# EAGLE schematic isoHV v0.7 (EAGLE 9.4.1)
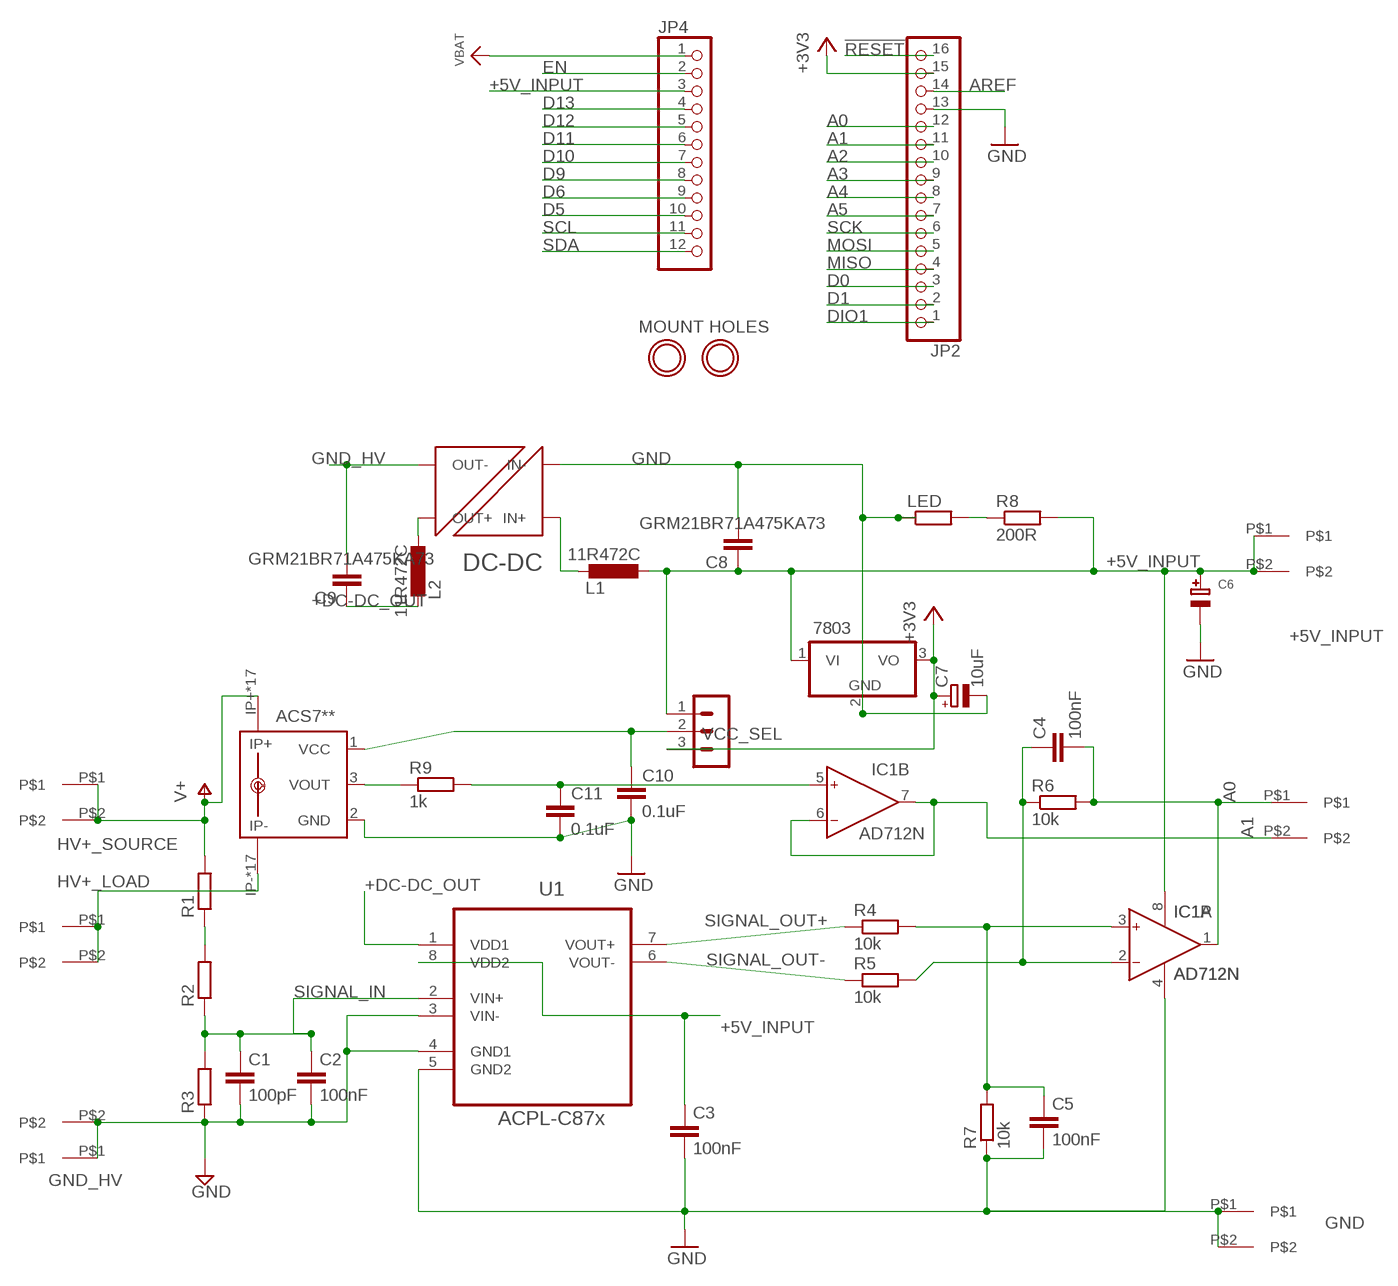
[diagram p0: schematic, sheet 1]

## Parts
7803  7805TV  [TO220V]
ACS7**  ACS758KCB-150B-PFF-T  [CB-PFF]
C1  100pF  C-EU025-025X050  [C025-025X050]
C2  100nF  C-EU025-025X050  [C025-025X050]
C3  100nF  C-EU025-025X050  [C025-025X050]
C4  100nF  C-EU025-025X050  [C025-025X050]
C5  100nF  C-EU025-025X050  [C025-025X050]
C6  CAP_ELECTROLYTICPTH_3.5MMGRID_10MMDIA  [CELEC_3.5MM_10MM]
C7  10uF  CPOL-EUB45181A  [B45181A]
C8  GRM21BR71A475KA73  C-EU025-025X050  [C025-025X050]
C9  GRM21BR71A475KA73  C-EU025-050X050  [C025-050X050]
C10  0.1uF  C-EU025-025X050  [C025-025X050]
C11  0.1uF  C-EU025-025X050  [C025-025X050]
IC1  AD712N  [DIL08]
JP2  HEADER-1X16ROUND  [1X16_ROUND]
JP4  HEADER-1X12  [1X12_ROUND]
L1  11R472C  L-EU0204V  [0204V]
L2  11R472C  L-EU0204V  [0204V]
LED  R-EU_0204/2V  [0204V]
R1  R-EU_0411/15  [0411/15]
R2  R-EU_0411/15  [0411/15]
R3  R-EU_0411/15  [0411/15]
R4  10k  R-EU_0204/7  [0204/7]
R5  10k  R-EU_0204/7  [0204/7]
R6  10k  R-EU_0204/7  [0204/7]
R7  10k  R-EU_0204/7  [0204/7]
R8  200R  R-EU_0204/2V  [0204V]
R9  1k  R-EU_0204/7  [0204/7]
U1  ACPL-C87x  ACPL-C79B-000E  [SOIC127P1150X330-8N]
U$1  7.62MM_TERMINAL_BLOCK  [7.62MM]
U$2  7.62MM_TERMINAL_BLOCK  [7.62MM]
U$3  7.62MM_TERMINAL_BLOCK  [7.62MM]
U$4  7.62MM_TERMINAL_BLOCK  [7.62MM]
U$5  7.62MM_TERMINAL_BLOCK  [7.62MM]
U$6  7.62MM_TERMINAL_BLOCK  [7.62MM]
U$7  NXF1  [NXF1]
U$12  MOUNTINGHOLE2.5  [MOUNTINGHOLE_2.5_PLATED]
U$13  MOUNTINGHOLE2.5  [MOUNTINGHOLE_2.5_PLATED]
VCC_SEL  MA03-1  [MA03-1]

## Nets
!RESET: JP2.16
+3V3: 7803.3(VO) C7.+ JP2.15 VCC_SEL.3
+5V_INPUT: 7803.1(VI) C3.1 C6.+ C8.1 IC1.8(P:V+) JP4.3 L1.2 R8.2 U1.8(VDD2) U$3.P$1 U$3.P$2 VCC_SEL.1
+DC-DC_OUT: C9.1 L2.1 U1.1(VDD1)
A0: C4.2 IC1.1(A:OUT) JP2.12 R6.2 U$5.P$1
A1: IC1.6(B:IN-) IC1.7(B:OUT) JP2.11 U$5.P$2
A2: JP2.10
A3: JP2.9
A4: JP2.8
A5: JP2.7
AREF: JP2.14
D0: JP2.3
D1: JP2.2
D5: JP4.10
D6: JP4.9
D9: JP4.8
D10: JP4.7
D11: JP4.6
D12: JP4.5
D13: JP4.4
DIO1: JP2.1
EN: JP4.2
GND: 7803.2(GND) ACS7**.2(GND) C3.2 C5.2 C6.- C7.- C8.2 C10.2 C11.2 IC1.4(P:V-) JP2.13 LED.1 R7.1 U1.5(GND2) U$4.P$1 U$4.P$2 U$7.P$1(IN-)
GND_HV: C1.2 C2.2 C9.2 R3.1 U1.3(VIN-) U1.4(GND1) U$2.P$1 U$2.P$2 U$7.P$7(OUT-) ; supply symbol labelled GND
HV+_LOAD: ACS7**.IP- ACS7**.IP-@2(IP-) ACS7**.IP-@3(IP-) ACS7**.IP-@4(IP-) ACS7**.IP-@5(IP-) ACS7**.IP-@6(IP-) ACS7**.IP-@7(IP-) ACS7**.IP-@8(IP-) ACS7**.IP-@9(IP-) ACS7**.IP-@10(IP-) ACS7**.IP-@11(IP-) ACS7**.IP-@12(IP-) ACS7**.IP-@13(IP-) ACS7**.IP-@14(IP-) ACS7**.IP-@15(IP-) ACS7**.IP-@16(IP-) ACS7**.IP-@17(IP-) U$6.P$1 U$6.P$2
HV+_SOURCE: ACS7**.IP+ ACS7**.IP+@2(IP+) ACS7**.IP+@3(IP+) ACS7**.IP+@4(IP+) ACS7**.IP+@5(IP+) ACS7**.IP+@6(IP+) ACS7**.IP+@7(IP+) ACS7**.IP+@8(IP+) ACS7**.IP+@9(IP+) ACS7**.IP+@10(IP+) ACS7**.IP+@11(IP+) ACS7**.IP+@12(IP+) ACS7**.IP+@13(IP+) ACS7**.IP+@14(IP+) ACS7**.IP+@15(IP+) ACS7**.IP+@16(IP+) ACS7**.IP+@17(IP+) R1.2 U$1.P$1 U$1.P$2 ; supply symbol labelled V+
MISO: JP2.4
MOSI: JP2.5
N$1: C5.1 IC1.3(A:IN+) R4.2 R7.2
N$2: R1.1 R2.2
N$3: ACS7**.1(VCC) C10.1 VCC_SEL.2
N$4: LED.2 R8.1
N$5: C4.1 IC1.2(A:IN-) R5.2 R6.1
N$6: C11.1 IC1.5(B:IN+) R9.2
N$7: L1.1 U$7.P$3(IN+)
N$8: L2.2 U$7.P$8(OUT+)
N$9: ACS7**.3(VOUT) R9.1
SCK: JP2.6
SCL: JP4.11
SDA: JP4.12
SIGNAL_IN: C1.1 C2.1 R2.1 R3.2 U1.2(VIN+)
SIGNAL_OUT+: R4.1 U1.7(VOUT+)
SIGNAL_OUT-: R5.1 U1.6(VOUT-)
VBAT: JP4.1

## Notes on the sheet
- MOUNT HOLES

## Library data of the parts
7803 = linear:78*: Positive VOLTAGE REGULATOR Source: http://cache.national.com/ds/LM/LM78L05.pdf http://www.fairchildsemi.com/ds/LM/LM7805.pdf
ACS7** = allegro:ACS758*: Thermally Enhanced, Fully Integrated, Hall Effect-Based Linear Current Sensor with 100 micro Ohm Current Conductor display layer 49 Reference in BRD and place VIAs on circles Source: http://www.allegromicro.com/en/Products/Part_Numbers/0758/0758.pdf; MPN: ACS7**; OC_FARNELL: 1718995; OC_NEWARK: 04R7129
C1-C5 C8-C11 = rcl:C-EU: CAPACITOR, European symbol; SPICEPREFIX: C
C6 = microbuilder:CAP_ELECTROLYTIC: Electrolytic Capacitors SMT PANASONIC_C - Size C Panasonic Electrolytic Aluminum Capacitor 47µF 16V 20% Electrolytic Capacitor [Digikey: PCE3890TR-ND] PANASONIC_D - Size D Panasonic Electrolytic Aluminum Capacitor 100µF 25V 20% Electrolytic Capacitor [Digikey: PCE3898TR-ND] PTH 3.5 mm grid, 8 mm diameter ... 3.5 mm grid, 10 mm diameter ...
C7 = rcl:CPOL-EU: POLARIZED CAPACITOR, European symbol; SPICEPREFIX: C
IC1 = analog-devices:AD712: Dual Precision, Low Cost, High Speed BiFET Op Amp Source: http://www.analog.com/static/imported-files/data_sheets/AD712.pdf; MF: ALTERA CORPORATION; MPN: AD712JNZ; OC_FARNELL: 9604898; OC_NEWARK: 59K4554
JP2 = microbuilder:HEADER-1X16: PIN HEADER
JP4 = microbuilder:HEADER-1X12
L1 L2 = rcl:L-EU: INDUCTOR, European symbol; SPICEPREFIX: L
LED R1-R9 = rcl:R-EU_: RESISTOR, European symbol; SPICEPREFIX: R
U1 = Avago_By_element14_Batch_1:ACPL-C79B-000E: Precision Miniature Isolation Amplifiers; DESCRIPTION: Precision Miniature Isolation Amplifiers; MPN: ACPL-C79B-000E; OC_FARNELL: 1854253; OC_NEWARK: 74R5803; PACKAGE: SOIC-8; SUPPLIER: AVAGO TECHNOLOGIES
U$1-U$6 = 7.62mm terminal block:7.62MM_TERMINAL_BLOCK
U$7 = NXF1:NXF1
U$12 U$13 = microbuilder:MOUNTINGHOLE: Mounting Hole For #2 screws (0.086"/2.18mm width, 0.094"/2.4mm hole) use 2.5mm
VCC_SEL = con-lstb:MA03-1: PIN HEADER; OC_FARNELL: unknown; OC_NEWARK: unknown